# EAGLE design Processor Controller (EAGLE 6.1)
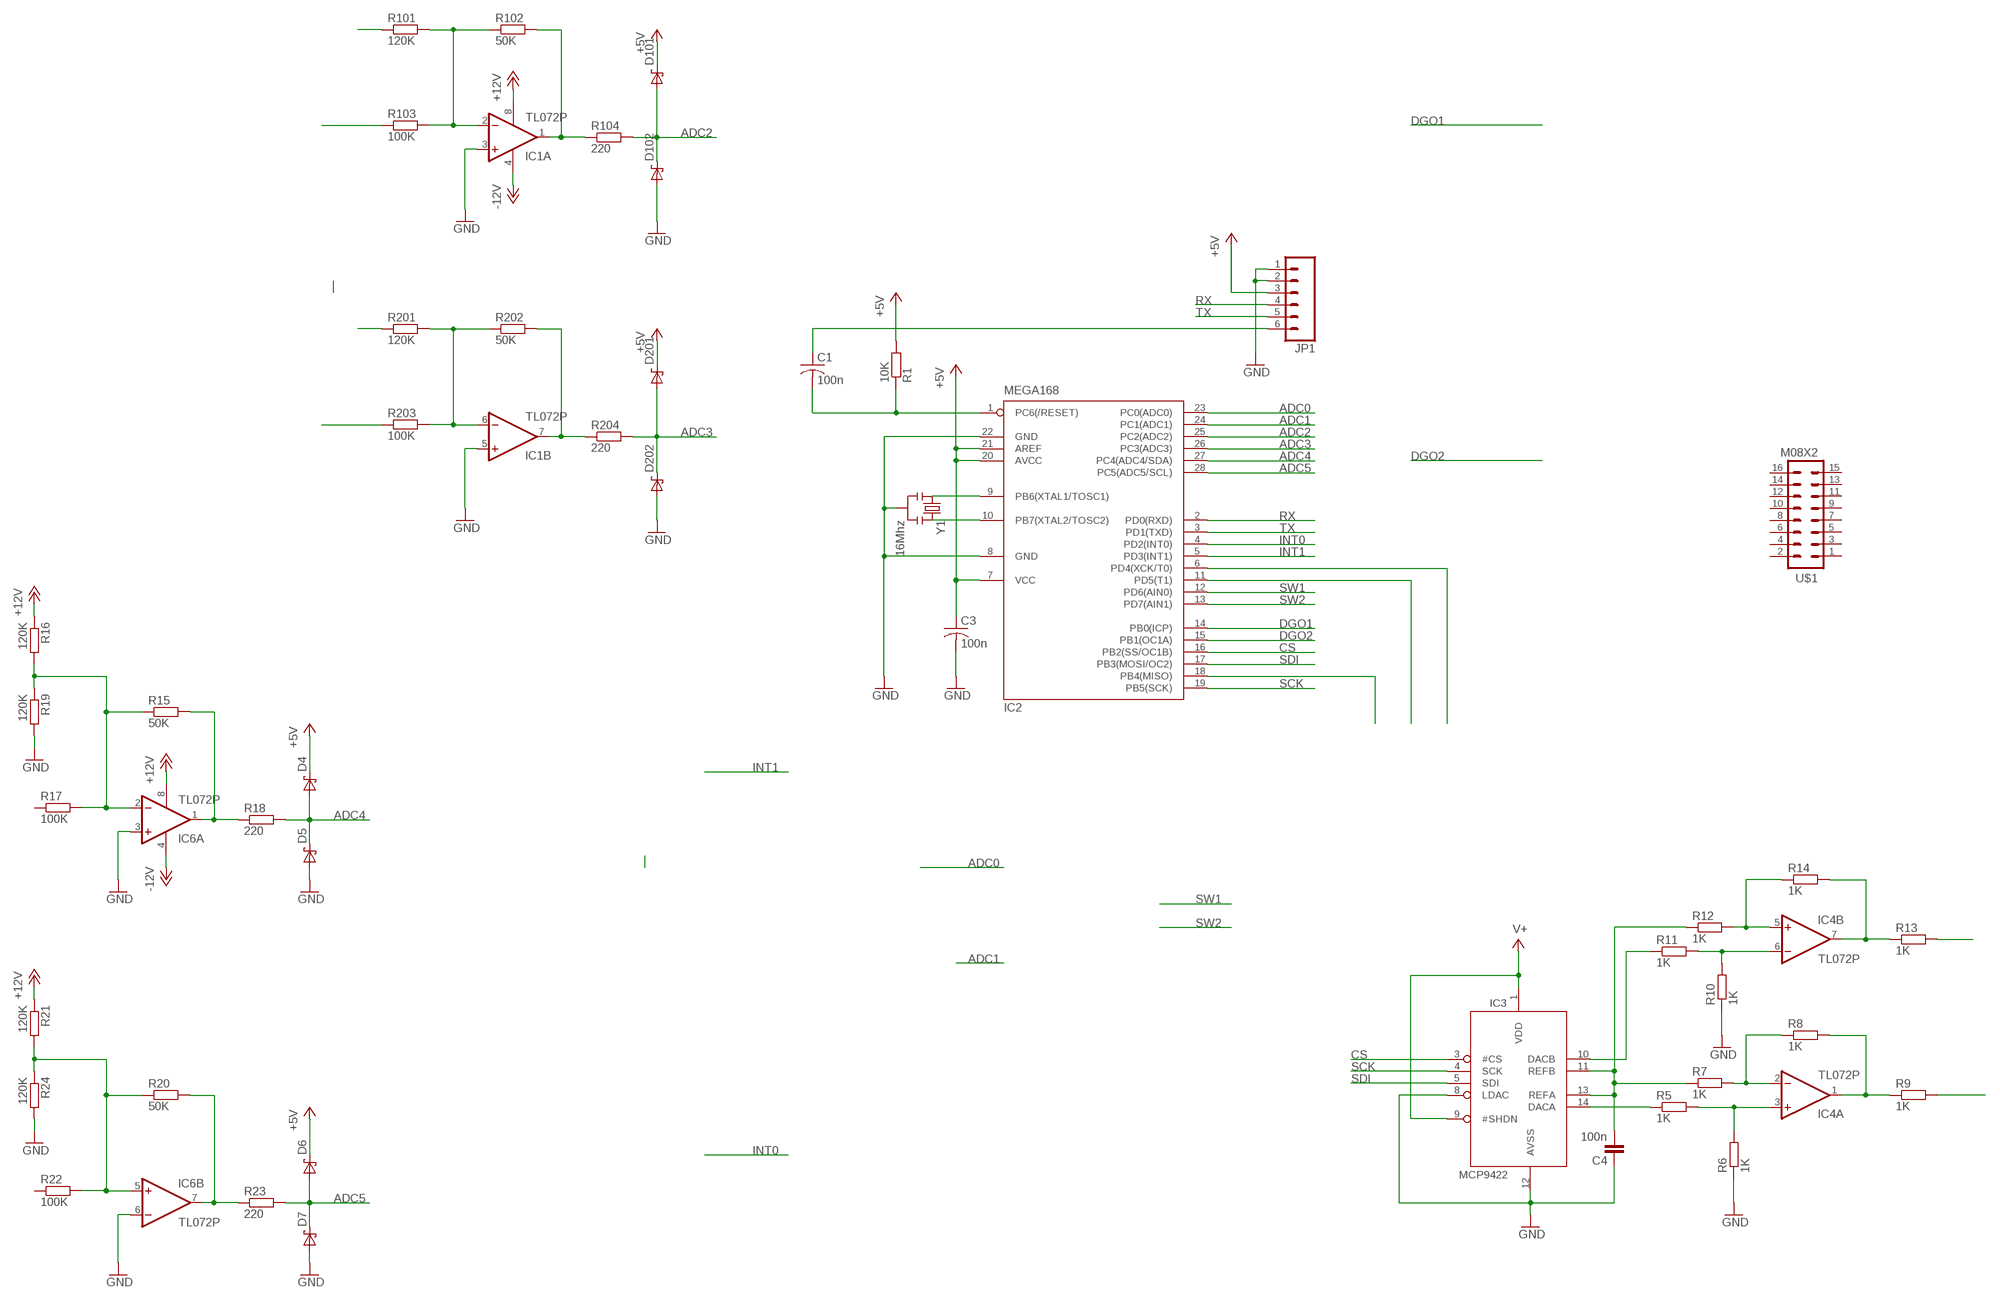
[diagram p0: schematic, sheet 1]

## Parts
C1  100n  C-US050-024X044  [C050-024X044]
C3  100n  C-US050-024X044  [C050-024X044]
C4  100n  C-EU050-030X075  [C050-030X075]
D4  DS_E2L  [E2LINE]
D5  DS_E2L  [E2LINE]
D6  DS_E2L  [E2LINE]
D7  DS_E2L  [E2LINE]
D101  DS_E2L  [E2LINE]
D102  DS_E2L  [E2LINE]
D201  DS_E2L  [E2LINE]
D202  DS_E2L  [E2LINE]
IC1  TL072P  [DIL08]
IC2  MEGA168  MEGA8-P  [DIL28-3]
IC3  MCP9422  [DIL14]
IC4  TL072P  [DIL08]
IC6  TL072P  [DIL08]
JP1  M06SIP  [1X06]
R1  10K  R-EU_0204/7  [0204/7]
R5  1K  R-EU_0204/7  [0204/7]
R6  1K  R-EU_0204/7  [0204/7]
R7  1K  R-EU_0204/7  [0204/7]
R8  1K  R-EU_0204/7  [0204/7]
R9  1K  R-EU_0204/7  [0204/7]
R10  1K  R-EU_0204/7  [0204/7]
R11  1K  R-EU_0204/7  [0204/7]
R12  1K  R-EU_0204/7  [0204/7]
R13  1K  R-EU_0204/7  [0204/7]
R14  1K  R-EU_0204/7  [0204/7]
R15  50K  R-EU_0204/7  [0204/7]
R16  120K  R-EU_0204/7  [0204/7]
R17  100K  R-EU_0204/7  [0204/7]
R18  220  R-EU_0204/7  [0204/7]
R19  120K  R-EU_0204/7  [0204/7]
R20  50K  R-EU_0204/7  [0204/7]
R21  120K  R-EU_0204/7  [0204/7]
R22  100K  R-EU_0204/7  [0204/7]
R23  220  R-EU_0204/7  [0204/7]
R24  120K  R-EU_0204/7  [0204/7]
R101  120K  R-EU_0204/7  [0204/7]
R102  50K  R-EU_0204/7  [0204/7]
R103  100K  R-EU_0204/7  [0204/7]
R104  220  R-EU_0204/7  [0204/7]
R201  120K  R-EU_0204/7  [0204/7]
R202  50K  R-EU_0204/7  [0204/7]
R203  100K  R-EU_0204/7  [0204/7]
R204  220  R-EU_0204/7  [0204/7]
U$1  M08X2  [2X8]
Y1  16Mhz  RESONATORPTH  [RESONATOR-PTH]

## Nets
+5V: C3.1 D4.1(K) D6.1(K) D101.1(K) D201.1(K) IC2.7(VCC) IC2.20(AVCC) IC2.21(AREF) JP1.3 R1.2
+12V: IC1.8(P:V+) IC6.8(P:V+) R16.1 R21.1
-12V: IC1.4(P:V-) IC6.4(P:V-)
ADC0: IC2.23(PC0(ADC0))
ADC1: IC2.24(PC1(ADC1))
ADC2: D101.2(A) D102.1(K) IC2.25(PC2(ADC2)) R104.2
ADC3: D201.2(A) D202.1(K) IC2.26(PC3(ADC3)) R204.2
ADC4: D4.2(A) D5.1(K) IC2.27(PC4(ADC4/SDA)) R18.2
ADC5: D6.2(A) D7.1(K) IC2.28(PC5(ADC5/SCL)) R23.2
ALTA: IC2.11(PD5(T1))
CS: IC2.16(PB2(SS/OC1B)) IC3.3(#CS)
DGO1: IC2.14(PB0(ICP))
DGO2: IC2.15(PB1(OC1A))
GND: C3.2 C4.1 D5.2(A) D7.2(A) D102.2(A) D202.2(A) IC1.3(A:+IN) IC1.5(B:+IN) IC2.8(GND) IC2.22(GND) IC3.8(LDAC) IC3.12(AVSS) IC6.3(A:+IN) IC6.6(B:-IN) JP1.1 JP1.2 R6.1 R10.1 R19.2 R24.2 Y1.2
INT0: IC2.4(PD2(INT0))
INT1: IC2.5(PD3(INT1))
N$2: IC1.2(A:-IN) R101.2 R102.1 R103.2
N$3: R101.1
N$4: IC1.1(A:OUT) R102.2 R104.1
N$5: R103.1
N$7: IC1.6(B:-IN) R201.2 R202.1 R203.2
N$8: R201.1
N$9: IC1.7(B:OUT) R202.2 R204.1
N$10: R203.1
N$11: C4.2 IC3.11(REFB) IC3.13(REFA) R7.1 R12.1
N$13: IC4.2(A:-IN) R7.2 R8.1
N$14: IC4.3(A:+IN) R5.2 R6.2
N$15: IC3.14(DACA) R5.1
N$16: IC4.1(A:OUT) R8.2 R9.1
N$17: R9.2
N$19: IC2.18(PB4(MISO))
N$20: IC2.9(PB6(XTAL1/TOSC1)) Y1.1
N$21: IC2.10(PB7(XTAL2/TOSC2)) Y1.3
N$22: IC6.2(A:-IN) R15.1 R16.2 R17.2 R19.1
N$29: C1.1 JP1.6
N$34: IC3.10(DACB) R11.1
N$35: IC4.6(B:-IN) R10.2 R11.2
N$38: IC4.5(B:+IN) R12.2 R14.1
N$39: C1.2 IC2.1(PC6(/RESET)) R1.1
N$41: IC4.7(B:OUT) R13.1 R14.2
N$42: R13.2
N$46: IC6.1(A:OUT) R15.2 R18.1
N$48: IC6.7(B:OUT) R20.2 R23.1
N$50: IC6.5(B:+IN) R20.1 R21.2 R22.2 R24.1
RX: IC2.2(PD0(RXD)) JP1.4
SCK: IC2.19(PB5(SCK)) IC3.4(SCK)
SDI: IC2.17(PB3(MOSI/OC2)) IC3.5(SDI)
SW1: IC2.12(PD6(AIN0))
SW2: IC2.13(PD7(AIN1))
TRIGA: IC2.6(PD4(XCK/T0))
TX: IC2.3(PD1(TXD)) JP1.5
V+: IC3.1(VDD) IC3.9(#SHDN)
Unconnected: R17.1 R22.1 U$1.1 U$1.2 U$1.3 U$1.4 U$1.5 U$1.6 U$1.7 U$1.8 U$1.9 U$1.10 U$1.11 U$1.12 U$1.13 U$1.14 U$1.15 U$1.16

## Power pins joined to a net without a drawn wire
V+: IC4.8(P:V+)
V-: IC4.4(P:V-)

## Library data of the parts
C1 C3 = rcl:C-US: CAPACITOR, American symbol
C4 = resistor:C-EU: CAPACITOR, European symbol
D4-D7 D101 D102 D201 D202 = zetex:DS_E2L: SHOTTKY DIODE; OC_FARNELL: unknown; OC_NEWARK: unknown
IC1 IC4 IC6 = linear:TL072: OP AMP
IC2 = atmel:MEGA8-P: MICROCONTROLLER 8 Kbytes FLASH, 1 kbytes SRAM, 512 bytes EEPROM, USART, 4-channel 10 bit ADC, 2-channel 8 bit ADC Pin compatible with Atmega48, ATMega88, ATMega168 Source: avr.lbr; OC_FARNELL: unknown; OC_NEWARK: unknown
IC3 = adafruit:MCP9422
JP1 = SparkFun:M06: Header 6 Standard 6-pin 0.1" header. Use with straight break away headers (SKU : PRT-00116), right angle break away headers (PRT-00553), swiss pins (PRT-00743), machine pins (PRT-00117), and female headers (PRT-00115). Molex polarized connector foot print use with SKU : PRT-08094 with associated crimp pins and housings. NOTES ON THE VARIANTS LOCK and LOCK_LONGPADS... This footprint was designed to help hold the alignment of a through-hole component (i.e. 6-pin header) while soldering it into place. You may notice that each hole has been shifted either up or down by 0.005 of an inch from it's more standard position (which is a perfectly straight line). This slight alteration caused the pins (the squares in the middle) to touch the edges of the holes. Because they are alternating, it causes a "brace" to hold the component in place. 0.005 has proven to be the perfect amount of "off-center" position when using our standard breakaway headers. Although looks a little odd when you look at the bare footprint, once you have a header in there, the alteration is very hard to notice. Also, if you push a header all the way into place, it is covered up entirely on the bottom side. This idea of altering the position of holes to aid alignment will be further integrated into the Sparkfun Library for other footprints. It can help hold any component with 3 or more connection pins.
R1 R5-R14 = rcl:R-EU_: RESISTOR, European symbol
R15-R24 R101-R104 R201-R204 = resistor:R-EU_: RESISTOR, European symbol
U$1 = SparkFun:M08X2
Y1 = SparkFun:RESONATOR: Resonator Small SMD resonator. This is the itty bitty 10/20MHz resonators with built in caps. CSTCE10M0G55 and CSTCE20M0V53. Footprint has been reviewed closely but hasn't been tested yet.

## Board
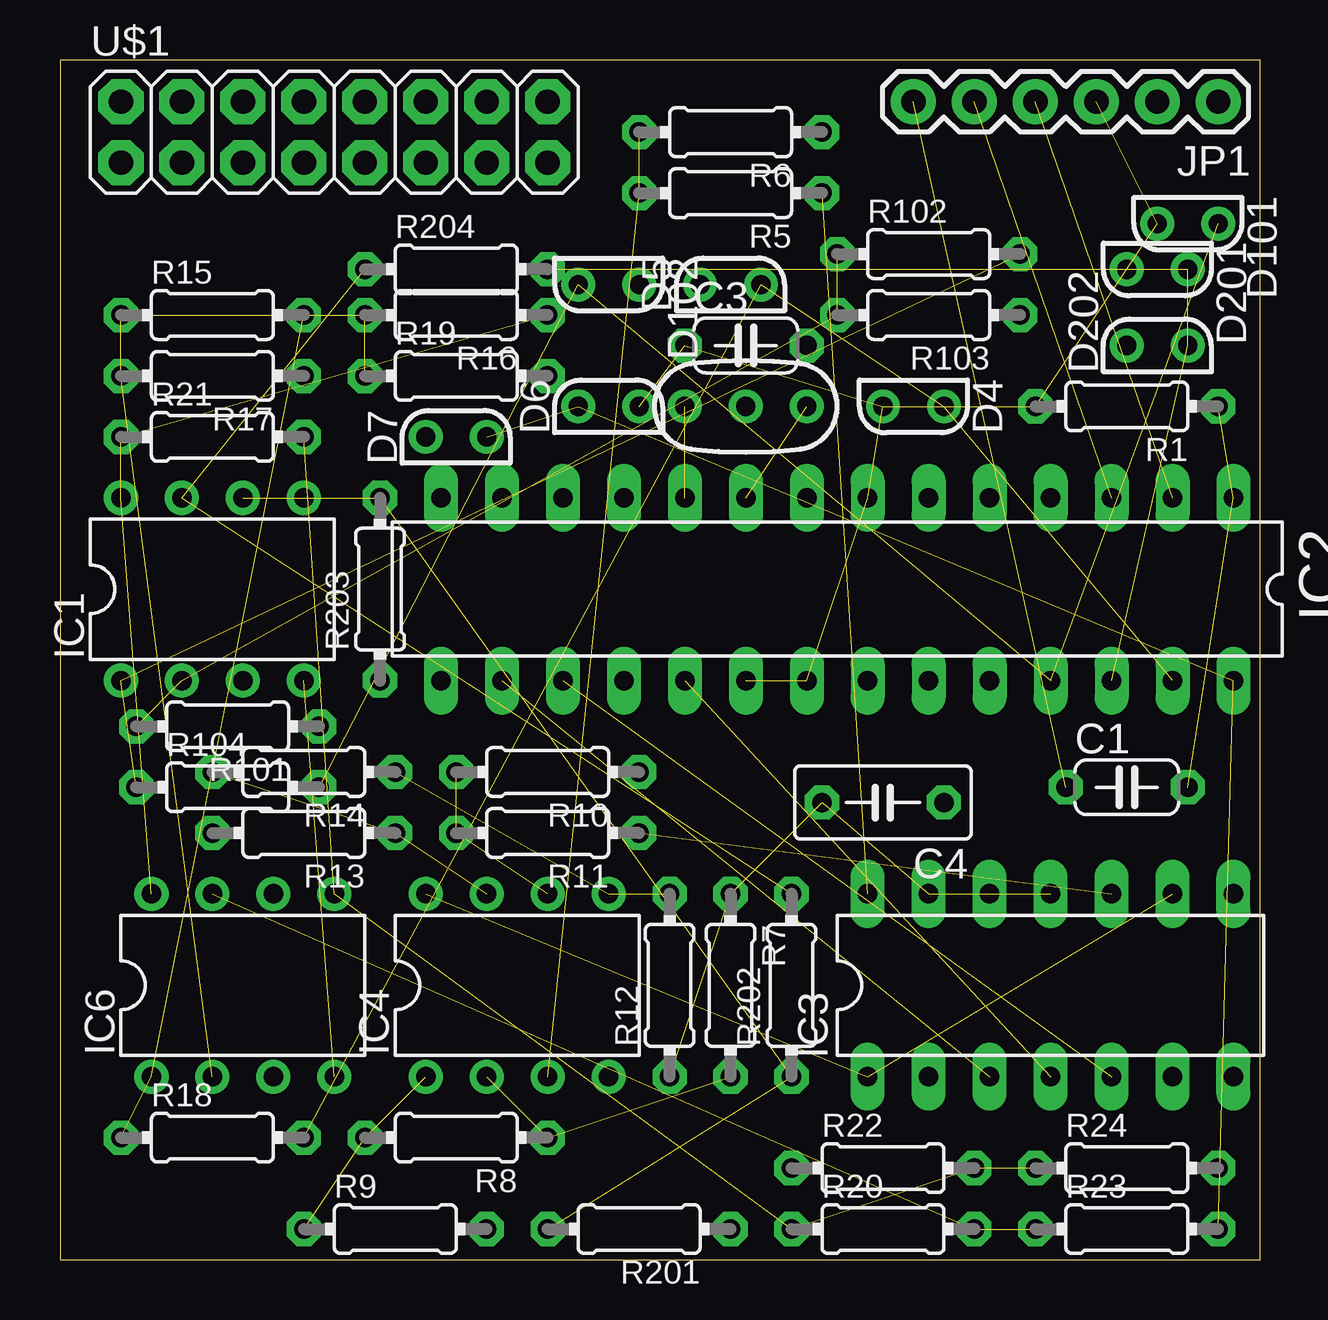
[diagram p1: board, top side]
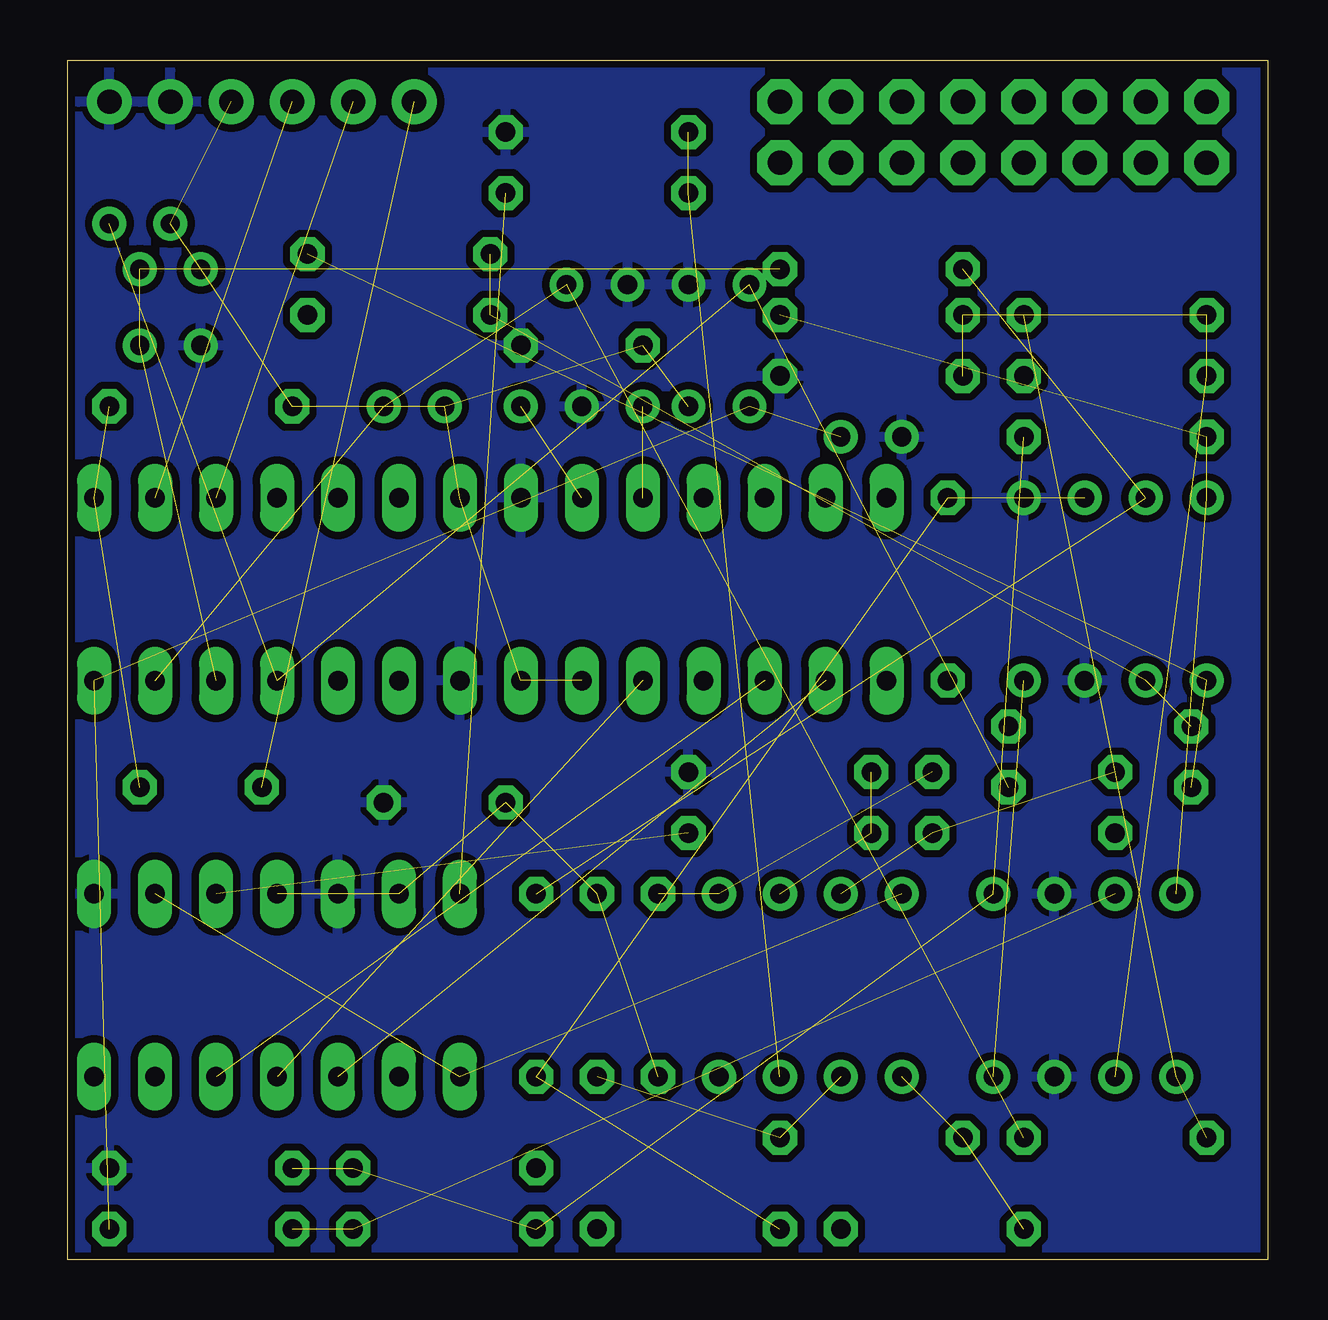
[diagram p2: board, bottom side, seen from below]

Size 50 x 50 mm. Coordinates in mm from the lower left corner, seen from the top.
Outline: 0,0 50,0 50,50 0,50 0,0
Copper layers (1*16): Top 0.035mm / dielectric 1.5mm / Bottom 0.035mm
Design rules: minimum track width 6mil, minimum drill 12mil, track to track 8mil, track to pad 8mil, pad to pad 8mil, via to via 8mil, smd to smd 0mil, copper to edge 10mil, drill to drill 10mil, minimum pad ring 12mil, minimum via ring 6mil, stop-mask expansion 2mil, vias tented up to drill 100mil, thermal gap 10mil

### Footprints (pad centres in the part's own frame; a part is rotated, then mirrored left to right if it is on the bottom)
C050-024X044 = drill 0.813 octagon: 1 -2.54,0; 2 2.54,0
C050-030X075 = drill 0.813 octagon: 1 -2.54,0; 2 2.54,0
E2LINE = drill 0.8 pad 1.397: 1 0,-1.27; 2 0,1.27
DIL08 = drill 0.813 pad 1.27: 1 -3.81,-3.81; 2 -1.27,-3.81; 3 1.27,-3.81; 4 3.81,-3.81; 5 3.81,3.81; 6 1.27,3.81; 7 -1.27,3.81; 8 -3.81,3.81
DIL28-3 = drill 0.813 long: 1 -16.51,-3.81; 2 -13.97,-3.81; 3 -11.43,-3.81; 4 -8.89,-3.81; 5 -6.35,-3.81; 6 -3.81,-3.81; 7 -1.27,-3.81; 8 1.27,-3.81; 9 3.81,-3.81; 10 6.35,-3.81; 11 8.89,-3.81; 12 11.43,-3.81; 13 13.97,-3.81; 14 16.51,-3.81; 15 16.51,3.81; 16 13.97,3.81; 17 11.43,3.81; 18 8.89,3.81; 19 6.35,3.81; 20 3.81,3.81; 21 1.27,3.81; 22 -1.27,3.81; 23 -3.81,3.81; 24 -6.35,3.81; 25 -8.89,3.81; 26 -11.43,3.81; 27 -13.97,3.81; 28 -16.51,3.81
DIL14 = drill 0.813 long: 1 -7.62,-3.81; 2 -5.08,-3.81; 3 -2.54,-3.81; 4 0,-3.81; 5 2.54,-3.81; 6 5.08,-3.81; 7 7.62,-3.81; 8 7.62,3.81; 9 5.08,3.81; 10 2.54,3.81; 11 0,3.81; 12 -2.54,3.81; 13 -5.08,3.81; 14 -7.62,3.81
1X06 = drill 1.016 pad 1.88: 1 0,0; 2 2.54,0; 3 5.08,0; 4 7.62,0; 5 10.16,0; 6 12.7,0
0204/7 = drill 0.813 octagon: 1 -3.81,0; 2 3.81,0
2X8 = drill 1.016 pad 1.88 octagon: 1 0,0; 2 0,2.54; 3 2.54,0; 4 2.54,2.54; 5 5.08,0; 6 5.08,2.54; 7 7.62,0; 8 7.62,2.54; 9 10.16,0; 10 10.16,2.54; 11 12.7,0; 12 12.7,2.54; 13 15.24,0; 14 15.24,2.54; 15 17.78,0; 16 17.78,2.54
RESONATOR-PTH = drill 0.8: 1 -2.54,0; 2 0,0; 3 2.54,0

### Placement (x,y rotation side)
C1  44.45,19.68 0 top
C3  28.57,38.1 0 top
C4  34.29,19.05 180 top
D4  35.56,35.56 270 top
D5  27.94,40.64 90 top
D6  22.86,35.56 90 top
D7  16.51,34.29 90 top
D101  46.99,43.18 270 top
D102  22.86,40.64 270 top
D201  45.72,41.27 270 top
D202  45.72,38.1 90 top
IC1  6.35,27.94 0 top
IC2  32.38,27.94 180 top
IC3  41.27,11.43 0 top
IC4  19.05,11.43 0 top
IC6  7.62,11.43 0 top
JP1  48.26,48.26 180 top
R1  44.45,35.56 180 top
R5  27.94,44.45 180 top
R6  27.94,46.99 180 top
R7  27.94,11.43 270 top
R8  16.51,5.08 180 top
R9  13.97,1.27 0 top
R10  20.32,20.32 180 top
R11  20.32,17.78 180 top
R12  25.4,11.43 90 top
R13  10.16,17.78 180 top
R14  10.16,20.32 180 top
R15  6.35,39.37 0 top
R16  16.51,39.37 180 top
R17  6.35,36.83 180 top
R18  6.35,5.08 0 top
R19  16.51,36.83 0 top
R20  34.29,1.27 0 top
R21  6.35,34.29 0 top
R22  34.29,3.81 0 top
R23  44.45,1.27 0 top
R24  44.45,3.81 0 top
R101  6.99,22.23 180 top
R102  36.2,41.91 0 top
R103  36.2,39.37 180 top
R104  6.99,19.68 0 top
R201  24.13,1.27 180 top
R202  30.48,11.43 90 top
R203  13.34,27.94 90 top
R204  16.51,41.27 0 top
U$1  2.54,45.72 0 top
Y1  28.57,35.56 180 top

### Tracks (layer width: path | path; a pad name or v marks a point on that pad's centre or on a via)
+5V  (9 unrouted)
+12V  (3 unrouted)
-12V  (1 unrouted)
ADC2  (3 unrouted)
ADC3  (3 unrouted)
ADC4  (3 unrouted)
ADC5  (3 unrouted)
CS  (1 unrouted)
GND
  pour Bottom (isolate 0.305): 0,0 0,50.8 50.8,50.8 50.8,0
N$2  (3 unrouted)
N$4  (2 unrouted)
N$7  (3 unrouted)
N$9  (2 unrouted)
N$11  (4 unrouted)
N$13  (2 unrouted)
N$14  (2 unrouted)
N$15  (1 unrouted)
N$16  (2 unrouted)
N$20  (1 unrouted)
N$21  (1 unrouted)
N$22  (4 unrouted)
N$29  (1 unrouted)
N$34  (1 unrouted)
N$35  (2 unrouted)
N$38  (2 unrouted)
N$39  (2 unrouted)
N$41  (2 unrouted)
N$46  (2 unrouted)
N$48  (2 unrouted)
N$50  (4 unrouted)
RX  (1 unrouted)
SCK  (1 unrouted)
SDI  (1 unrouted)
TX  (1 unrouted)
V+  (2 unrouted)